# Altium project 充电_2020_8_2.PrjPCB
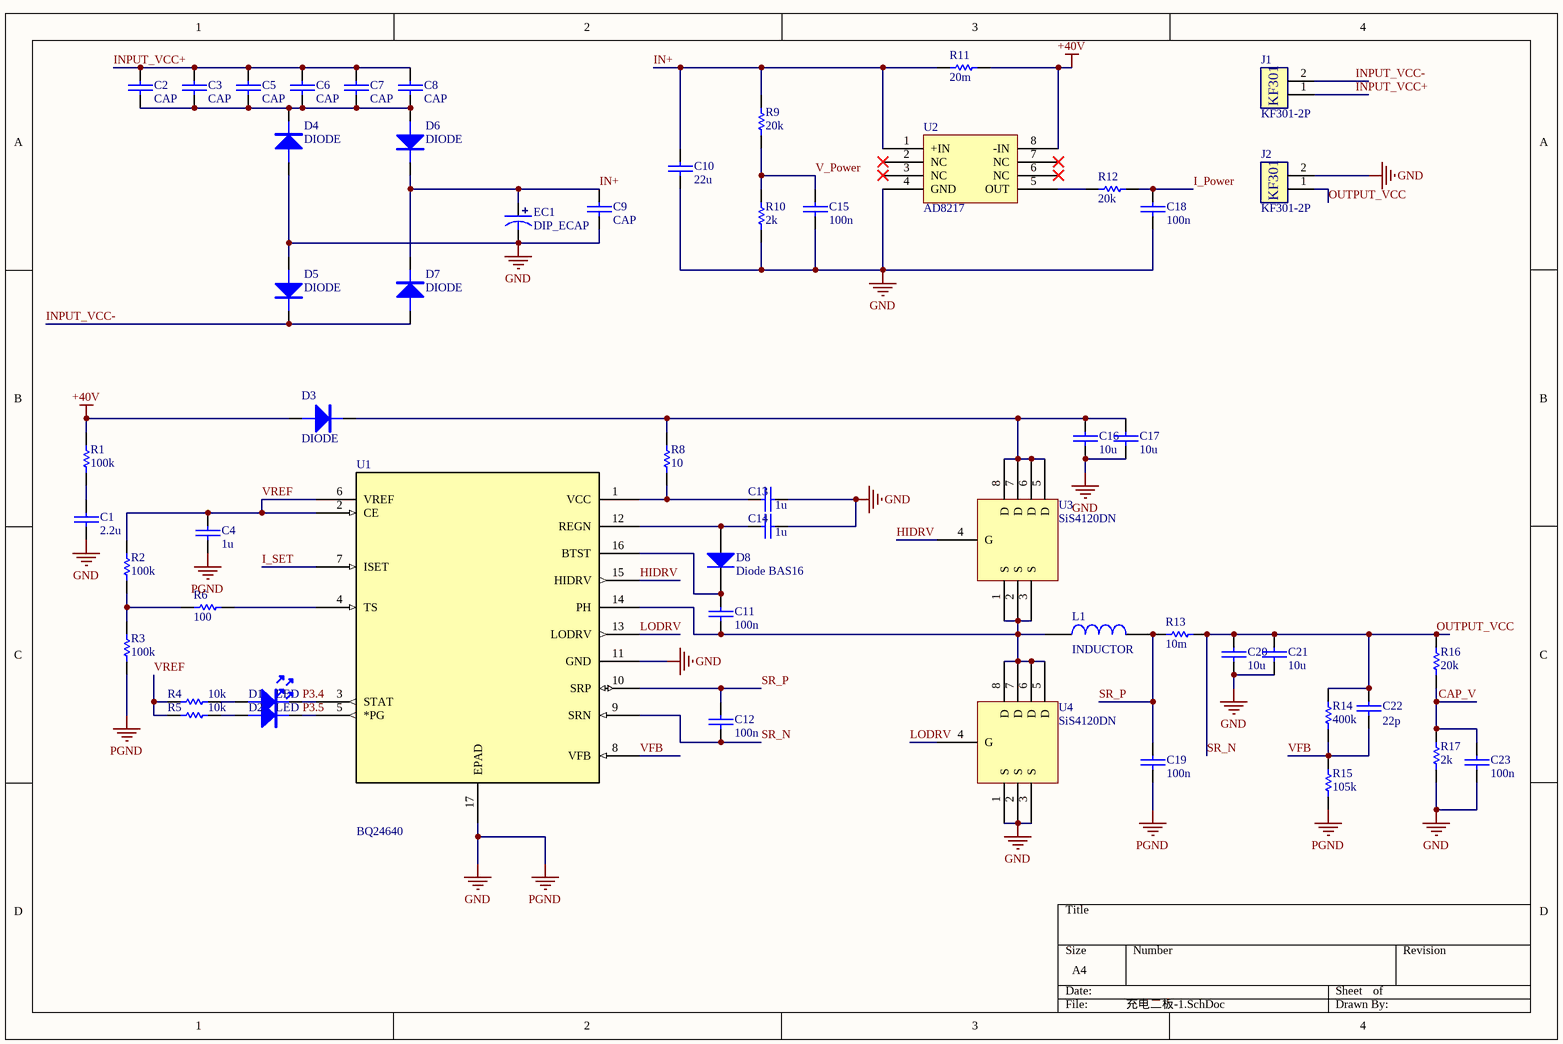
[diagram p0: 充电二板-1.SchDoc]
2 sheets, 72 parts. Net scope: global (net labels, ports and power ports of the same name join across sheets).
Board file: 充电_2020_8_2.PcbDoc
Sheets:
  充电二板-1.SchDoc
  充电二板-2.SchDoc

## Sheet 充电二板-1.SchDoc
size A4

### Parts
C1  2.2u  [0603C]
C2  CAP  [1206C]
C3  CAP  [1206C]
C4  1u  [0603C]
C5  CAP  [1206C]
C6  CAP  [1206C]
C7  CAP  [1206C]
C8  CAP  [1206C]
C9  CAP  [1206C]
C10  22u  [1206C]
C11  100n  [0603C]
C12  100n  [0603C]
C13  1u  [0603C]
C14  1u  [0603C]
C15  100n  [0603C]
C16  10u  [1206C]
C17  10u  [1206C]
C18  100n  [0603C]
C19  100n  [0603C]
C20  10u  [1206C]
C21  10u  [1206C]
C22  22p  [0603C]
C23  100n  [0603C]
D1  LED  [LED-0603W]
D2  LED  [LED-0603W]
D3  DIODE  [SMA/DO-214AC]
D4  DIODE  [SMA/DO-214AC]
D5  DIODE  [SMA/DO-214AC]
D6  DIODE  [SMA/DO-214AC]
D7  DIODE  [SMA/DO-214AC]
D8  Diode BAS16  [SOT-23_N]
EC1  DIP_ECAP  [DIP-EC3.5X8X11.5]
J1  KF301-2P  [KF301-5.0-2P]
J2  KF301-2P  [KF301-5.0-2P]
L1  INDUCTOR  [CDRH73]
R1  100k  [0603R]
R2  100k  [0603R]
R3  100k  [0603R]
R4  10k  [0603R]
R5  10k  [0603R]
R6  100  [0603R]
R8  10  [0603R]
R9  20k  [0603R]
R10  2k  [0603R]
R11  20m  [2512R]
R12  20k  [0603R]
R13  10m  [2512R]
R14  400k  [0603R]
R15  105k  [0603R]
R16  20k  [0603R]
R17  2k  [0603R]
U1  BQ24640  [BQ24640]
U2  AD8217  [AD8127]
U3  SiS4120DN  [SiS412DN]
U4  SiS4120DN  [SiS412DN]

### Nets
+40V: D3.A R1.2 R11.1 U2.8(-IN)
GND: C1.1 C4.1 C9.1 C10.1 C13.1 C14.1 C15.1 C16.1 C17.1 C18.1 C19.1 C20.1 C21.1 C23.1 D4.A D5.A EC1.2 J2.2 R3.1 R10.1 R15.1 R17.1 U1.11(GND) U1.17(EPAD) U2.4(GND) U4.1(S) U4.2(S) U4.3(S)  [also labelled PGND]
CAP_V: C23.2 R16.1 R17.2
HIDRV: U1.15(HIDRV) U3.4(G)
I_Power: C18.2 R12.1
I_SET: U1.7(ISET)
IN+: C9.2 C10.2 D6.K D7.K EC1.1 R9.2 R11.2 U2.1(+IN)
INPUT_VCC+: C2.2 C3.2 C5.2 C6.2 C7.2 C8.2 J1.1
INPUT_VCC-: D5.K D7.A J1.2
LODRV: U1.13(LODRV) U4.4(G)
OUTPUT_VCC: C12.2 C20.2 C21.2 C22.2 J2.1 R13.1 R14.2 R16.2 U1.9(SRN)  [also labelled SR_N]
P3.4: D1.K U1.3(STAT)
P3.5: D2.K U1.5(*PG)
SR_P: C12.1 C19.2 L1.2 R13.2 U1.10(SRP)
V_Power: C15.2 R9.1 R10.2  [project net P0.1]
VFB: C22.1 R14.1 R15.2 U1.8(VFB)
VREF: C4.2 R2.2 R4.2 R5.2 U1.2(CE) U1.6(VREF)
NetC1_2: C1.2 R1.1
NetC2_1: C2.1 C3.1 C5.1 C6.1 C7.1 C8.1 D4.K D6.A
NetC11_1: C11.1 D8.3(K) U1.16(BTST)
NetC11_2: C11.2 L1.1 U1.14(PH) U3.1(S) U3.2(S) U3.3(S) U4.5(D) U4.6(D) U4.7(D) U4.8(D)
NetC13_2: C13.2 R8.2 U1.1(VCC)
NetC14_2: C14.2 D8.1(A) U1.12(REGN)
NetC16_2: C16.2 C17.2 D3.K R8.1 U3.5(D) U3.6(D) U3.7(D) U3.8(D)
NetD1_A: D1.A R4.1
NetD2_A: D2.A R5.1
NetR2_1: R2.1 R3.2 R6.2
NetR6_1: R6.1 U1.4(TS)
NetR12_2: R12.2 U2.5(OUT)

Not connected (* = marked no-connect by the designer): U2 2(NC)* 3(NC)* 6(NC)* 7(NC)*

### Notes on the sheet
- (in symbol KF301-2P) KF301

### Library data of the parts
C1-C23 = CAP: 无极性电容
D3-D7 = DIODE: 普通二极管
D8 = Diode BAS16: Silicon Switching Diode for High-Speed Switching; Note: Pin 2 is not connected and not drawn.; Published: 21-Mar-2003; LatestRevisionDate: 29-May-2009; LatestRevisionNote: IPC-7351 Footprint Added.; DatasheetVersion: Oct-1999; PackageVersion: Sep-2001; PackageReference: SOT-23; Publisher: Altium Limited; PackageDescription: 3-Pin SOT-23 Package 0.95 mm Pitch, 2.5 mm Lead Span; ComponentLink1Description: Manufacturer Link; ComponentLink1URL: http://www.infineon.com/; ComponentLink2Description: Datasheet; ComponentLink2URL: http://www.infineon.com/upload/Document/cmc_upload/documents/012/5331/bas16series.pdf
EC1 = DIP_ECAP: 直插电解电容
R1-R6 R8-R17 = RES

## Sheet 充电二板-2.SchDoc
size A4
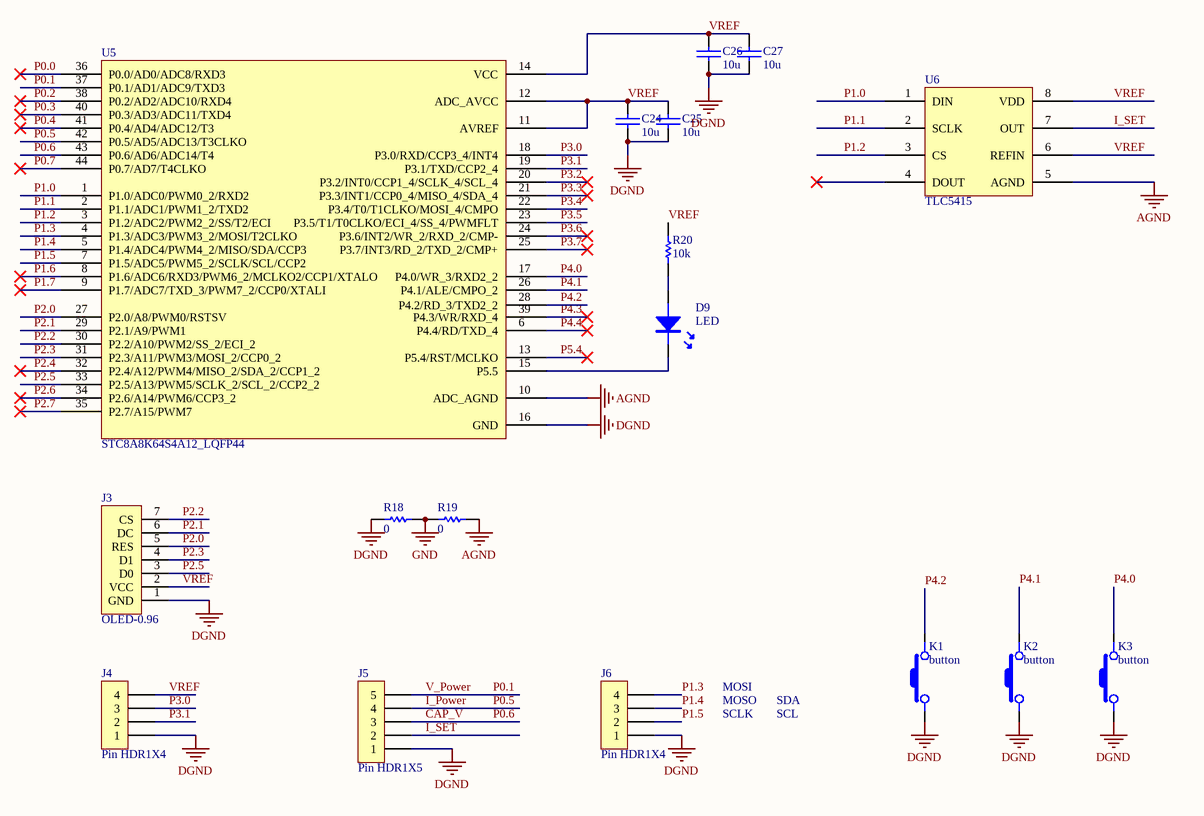
[diagram p1: 充电二板-2.SchDoc]

### Parts
C24  10u  [0603C]
C25  10u  [0603C]
C26  10u  [0603C]
C27  10u  [0603C]
D9  LED  [LED-0603W]
J3  OLED-0.96  [OLED-0.96]
J4  Pin HDR1X4  [Pin HDR1X4/2.54mm-S]
J5  Pin HDR1X5  [Pin HDR1X5/2.54mm-S]
J6  Pin HDR1X4  [Pin HDR1X4/2.54mm-S]
K1  button  [button]
K2  button  [button]
K3  button  [button]
R18  0  [0603R]
R19  0  [0603R]
R20  10k  [0603R]
U5  STC8A8K64S4A12_LQFP44  [LQFP144]
U6  TLC5415  [TLC5415]

### Nets
AGND: R19.2 U5.10(ADC_AGND) U6.5(AGND)
DGND: C24.1 C25.1 C26.1 C27.1 J3.1(GND) J4.1 J5.1 J6.1 K1.1 K2.1 K3.1 R18.1 U5.16(GND)
GND: R18.2 R19.1
CAP_V: J5.3 U5.43(P0.6/AD6/ADC14/T4)  [also labelled P0.6]
I_Power: J5.4 U5.42(P0.5/AD5/ADC13/T3CLKO)  [also labelled P0.5]
I_SET: J5.2 U6.7(OUT)
P0.0: U5.36(P0.0/AD0/ADC8/RXD3)
P0.1: J5.5 U5.37(P0.1/AD1/ADC9/TXD3)  [also labelled V_Power]
P0.2: U5.38(P0.2/AD2/ADC10/RXD4)
P0.3: U5.40(P0.3/AD3/ADC11/TXD4)
P0.4: U5.41(P0.4/AD4/ADC12/T3)
P0.7: U5.44(P0.7/AD7/T4CLKO)
P1.0: U5.1(P1.0/ADC0/PWM0_2/RXD2) U6.1(DIN)
P1.1: U5.2(P1.1/ADC1/PWM1_2/TXD2) U6.2(SCLK)
P1.2: U5.3(P1.2/ADC2/PWM2_2/SS/T2/ECI) U6.3(CS)
P1.3: J6.4 U5.4(P1.3/ADC3/PWM3_2/MOSI/T2CLKO)
P1.4: J6.3 U5.5(P1.4/ADC4/PWM4_2/MISO/SDA/CCP3)
P1.5: J6.2 U5.7(P1.5/ADC5/PWM5_2/SCLK/SCL/CCP2)
P1.6: U5.8(P1.6/ADC6/RXD3/PWM6_2/MCLKO2/CCP1/XTALO)
P1.7: U5.9(P1.7/ADC7/TXD_3/PWM7_2/CCP0/XTALI)
P2.0: J3.5(RES) U5.27(P2.0/A8/PWM0/RSTSV)
P2.1: J3.6(DC) U5.29(P2.1/A9/PWM1)
P2.2: J3.7(CS) U5.30(P2.2/A10/PWM2/SS_2/ECI_2)
P2.3: J3.4(D1) U5.31(P2.3/A11/PWM3/MOSI_2/CCP0_2)
P2.4: U5.32(P2.4/A12/PWM4/MISO_2/SDA_2/CCP1_2)
P2.5: J3.3(D0) U5.33(P2.5/A13/PWM5/SCLK_2/SCL_2/CCP2_2)
P2.6: U5.34(P2.6/A14/PWM6/CCP3_2)
P2.7: U5.35(P2.7/A15/PWM7)
P3.0: J4.3 U5.18(P3.0/RXD/CCP3_4/INT4)
P3.1: J4.2 U5.19(P3.1/TXD/CCP2_4)
P3.2: U5.20(P3.2/INT0/CCP1_4/SCLK_4/SCL_4)
P3.3: U5.21(P3.3/INT1/CCP0_4/MISO_4/SDA_4)
P3.4: U5.22(P3.4/T0/T1CLKO/MOSI_4/CMPO)
P3.5: U5.23(P3.5/T1/T0CLKO/ECI_4/SS_4/PWMFLT)
P3.6: U5.24(P3.6/INT2/WR_2/RXD_2/CMP-)
P3.7: U5.25(P3.7/INT3/RD_2/TXD_2/CMP+)
P4.0: K3.2 U5.17(P4.0/WR_3/RXD2_2)
P4.1: K2.2 U5.26(P4.1/ALE/CMPO_2)
P4.2: K1.2 U5.28(P4.2/RD_3/TXD2_2)
P4.3: U5.39(P4.3/WR/RXD_4)
P4.4: U5.6(P4.4/RD/TXD_4)
P5.4: U5.13(P5.4/RST/MCLKO)
VREF: C24.2 C25.2 C26.2 C27.2 J3.2(VCC) J4.4 R20.1 U5.11(AVREF) U5.12(ADC_AVCC) U5.14(VCC) U6.6(REFIN) U6.8(VDD)
NetD9_A: D9.A R20.2
NetD9_K: D9.K U5.15(P5.5)

Not connected (* = marked no-connect by the designer): U6 4(DOUT)*

### Notes on the sheet
- MOSI
- MOSO
- SCLK
- SDA
- SCL

### Library data of the parts
C24-C27 = CAP: 无极性电容
R18-R20 = RES

## Nets that join several sheets
GND: 充电二板-1 (28 pins), 充电二板-2 (R18.2 R19.1)
CAP_V: 充电二板-1 (C23.2 R16.1 R17.2), 充电二板-2 (J5.3 U5.43)
I_Power: 充电二板-1 (C18.2 R12.1), 充电二板-2 (J5.4 U5.42)
I_SET: 充电二板-1 (U1.7), 充电二板-2 (J5.2 U6.7)
P0.1: 充电二板-1 (C15.2 R9.1 R10.2), 充电二板-2 (J5.5 U5.37)
P3.4: 充电二板-1 (D1.K U1.3), 充电二板-2 (U5.22)
P3.5: 充电二板-1 (D2.K U1.5), 充电二板-2 (U5.23)
VREF: 充电二板-1 (6 pins), 充电二板-2 (12 pins)